# Altium project UC2010.PrjPcb
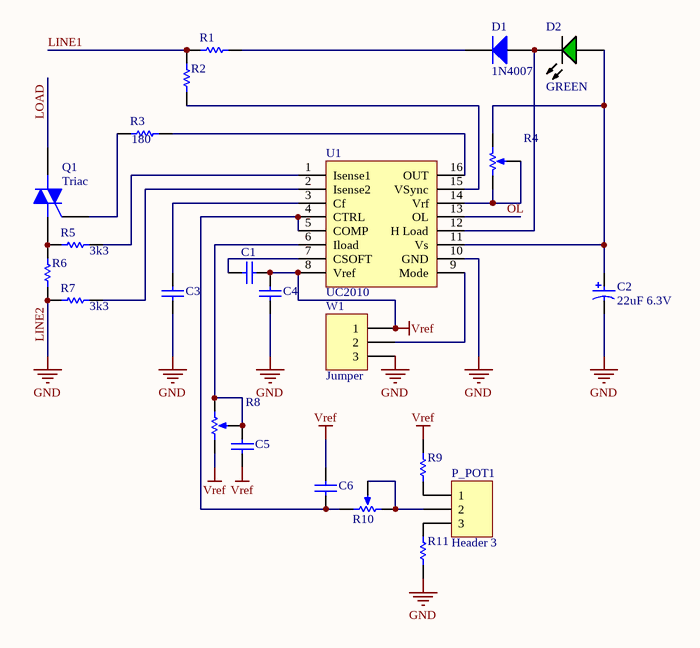
[diagram p0: UC2010.SchDoc]
1 sheet, 23 parts. Net scope: global (net labels, ports and power ports of the same name join across sheets).
Board file: PCB1.PcbDoc

## Sheet UC2010.SchDoc
size A4

### Parts
C1  100nF 100V  [RC_0603]  (value not drawn)
C2  22uF 6.3V  [RR_CAP-B]
C3  100nF 100V  [RC_0805_T1.1]  (value not drawn)
C4  100nF 100V  [RC_1206_T0.95]  (value not drawn)
C5  100nF 100V  [RC_0805_T1.1]  (value not drawn)
C6  100nF 100V  [RC_0805_T1.1]  (value not drawn)
D1  1N4007  [RR_DO-41]
D2  GREEN  [RR_LED-0603-GREEN]
P_POT1  Header 3  [R_POT_16K1]
Q1  Triac  [RR_D2PAK]
R1  Res1  [AXIAL-0.7]  (value not drawn)
R2  20k 0.1%  [RR_1206]  (value not drawn)
R3  180  [RR_1206]
R4  RPot  [VR5]  (value not drawn)
R5  3k3  [RR_0805]
R6  Res1  [AXIAL-0.7]  (value not drawn)
R7  3k3  [RR_0805]
R8  RPot  [VR5]  (value not drawn)
R9  3k3  [RR_1206]  (value not drawn)
R10  RPot  [VR5]  (value not drawn)
R11  3k3  [RR_1206]  (value not drawn)
U1  UC2010  [RR_SO16]
W1  Jumper  [JUMPER-2pos]

### Nets
LINE2: C2.2 C3.1 C4.1 R6.2 R7.2 R11.2 U1.10(GND) W1.3  [also labelled GND]
Vref: C1.1 C4.2 C5.1 C6.2 R8.3(TOP) R9.1 U1.8(Vref) W1.1
LINE1: R1.2 R2.2
LOAD: Q1.2(M2)
OL: U1.13(OL)
NetC1_2: C1.2 U1.7(CSOFT)
NetC2_1: C2.1 D2.1(A) R4.3(TOP) U1.11(Vs)
NetC3_2: C3.2 U1.3(Cf)
NetC5_2: C5.2 R8.1(BOT) R8.2(TAP) U1.6(Iload)
NetC6_1: C6.1 R10.1(BOT) U1.4(CTRL) U1.5(COMP)
NetD1_1: D1.1(A) D2.2(K) U1.12(H_Load)
NetD1_2: D1.2(K) R1.1
NetP_POT1_1: P_POT1.1 R9.2
NetP_POT1_2: P_POT1.2 R10.2(TAP) R10.3(TOP)
NetP_POT1_3: P_POT1.3 R11.1
NetQ1_1: Q1.1(M1) R5.1 R6.1
NetQ1_3: Q1.3(G) R3.2
NetR2_1: R2.1 U1.15(VSync)
NetR3_1: R3.1 U1.16(OUT)
NetR4_1: R4.1(BOT) R4.2(TAP) U1.14(Vrf)
NetR5_2: R5.2 U1.1(Isense1)
NetR7_1: R7.1 U1.2(Isense2)
NetU1_9: U1.9(Mode) W1.2

### Library data of the parts
C1 C3-C6 = CAP-0805-104-100V: CAPACITOR CHIP; Manufacturer: AVX Corporation; Value: CAP CER 0.1UF 100V X7R 0805; Order Number: C0805C104K1RACTU; Cost: 0,29; Package: 0805
C2 = CAP-TANT-B-226-6.3V: CAPACITOR TANTAL CASE B; Manufacturer: AVX Corporation; Value: CAP TANT 22UF 6.3V 10% 1411; Order number: TPSB226K006R0600; Package: B; Cost: 0,62
D1 = 1N4007: DIODE GENERAL 1000V 1A; Manufacturer: ON Semiconductor; Value: DIODE GEN PURP 1KV 1A DO41; Order Number: 1N4007; Package: DO41; Cost: 0,18
D2 = LED-0603-GREEN: DIODE LED 0603 GREEN; Manufacturer: Wurth Electronics Inc.; Order Number: 150060GS75000; Value: LED GREEN CLEAR 0603 SMD; Package: 0603; Cost: 0,14
P_POT1 W1 = Header 3: Header, 3-Pin
  P_POT1: LatestRevisionDate: 17-Jul-2002; LatestRevisionNote: Re-released for DXP Platform.; Publisher: Altium Limited
Q1 = Triac: Silicon Bidirectional Triode Thyristor; Note: Pin 2 is electrically connected to Pin 4 (TAB); Published: 29-Sep-2000; LatestRevisionDate: 17-Jul-2002; LatestRevisionNote: Re-released for DXP Platform.; DatasheetVersion: 1999; PackageReference: 369-03; Publisher: Altium Limited; PackageDescription: TO, Thru-Hole, Vertical, Heatsink Mounted; 3 In-Line Leads; Pitch 2.28 mm; ComponentLink1Description: Manufacturer Link; ComponentLink1URL: http://www.motorola.com/
R1 R6 = Res1: Resistor; Value: 1K; Published: 8-Jun-2000; LatestRevisionDate: 17-Jul-2002; LatestRevisionNote: Re-released for DXP Platform.; PackageReference: AXIAL-0.3; Publisher: Altium Limited; PackageDescription: Axial Device, Thru-Hole; 2 Leads; 0.3 in Pin Spacing
R2 R3 R5 R7 R9 R11 = RES-1206-20K-0.1%: RESISTOR; Manufacturer: Susumu; Value: RES SMD 20K OHM 0.1% 1/4W 1206; Order Number: RG3216P-2002-B-T1; Cost: 0,68; Package: 1206
R4 R8 R10 = RPot: Potentiometer; Sim Note: Enter the Resistance value and the set point into parameter fields.; Set Position: 0.5; Value: 1K; Published: 8-Jun-2000; LatestRevisionDate: 17-Jul-2002; LatestRevisionNote: Re-released for DXP Platform.; PackageReference: VR5; Publisher: Altium Limited; PackageDescription: Variable Resistor, Thru-Hole; 3 Leads